# Altium schematic sheet MOS输出.SchDoc
size A4
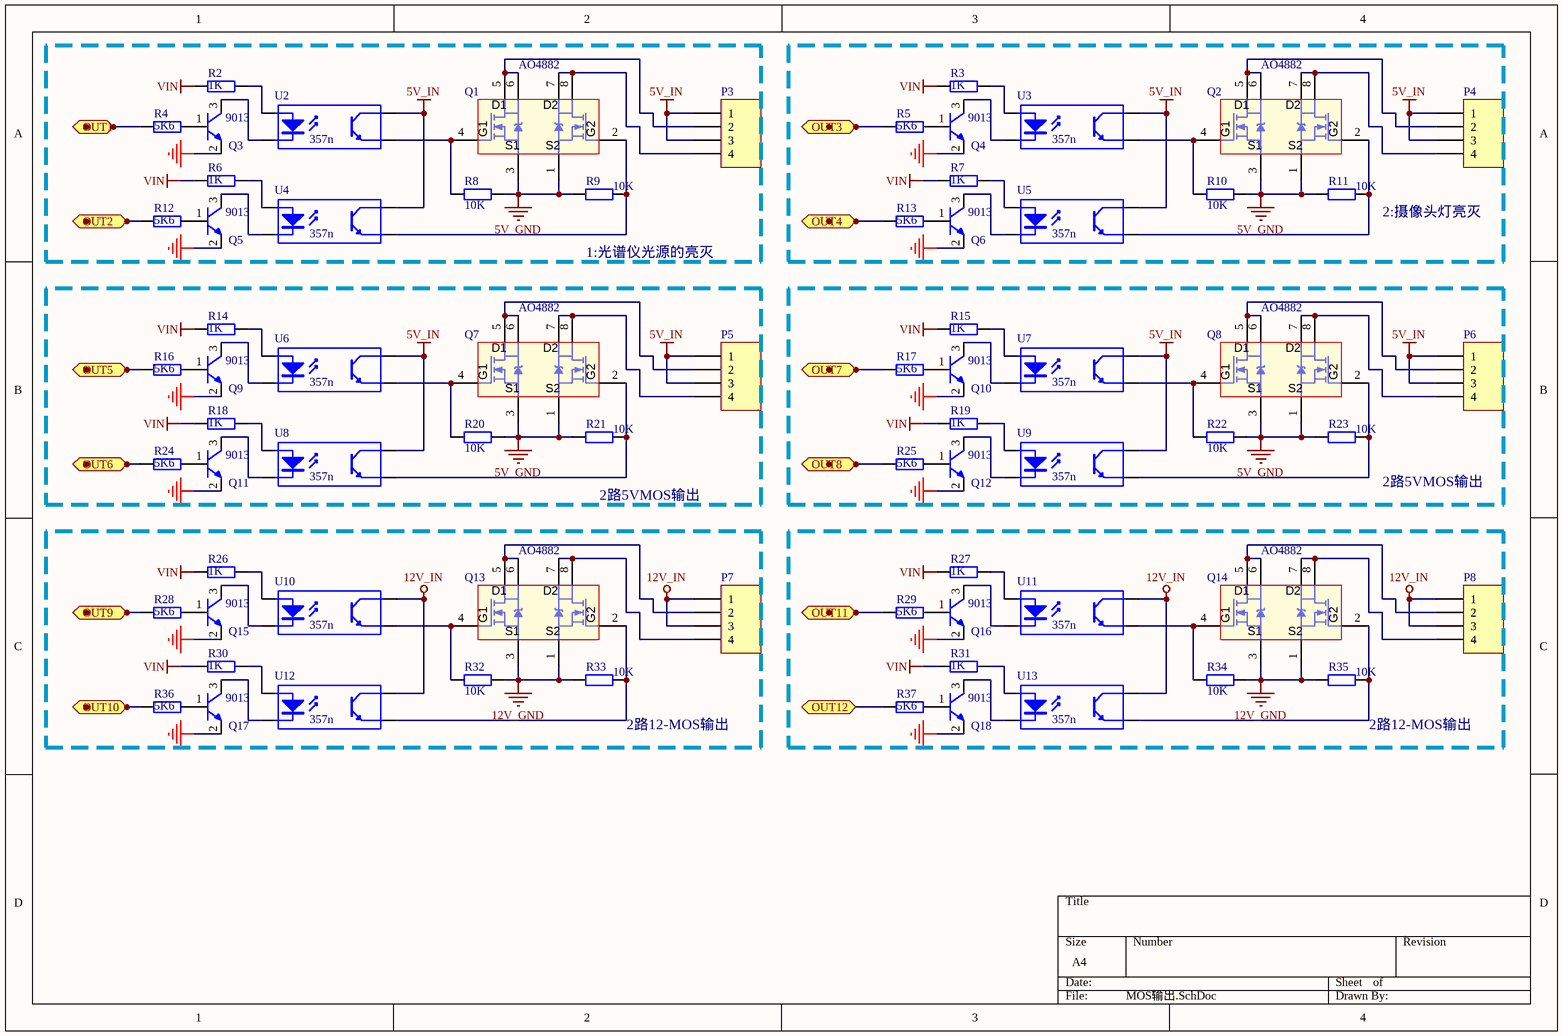
[diagram p0: MOS输出.SchDoc]

## Parts
P3  (no value)  [CAN3.81W/4]
P4  (no value)  [CAN3.81W/4]
P5  (no value)  [CAN3.81W/4]
P6  (no value)  [CAN3.81W/4]
P7  (no value)  [CAN3.81W/4]
P8  (no value)  [CAN3.81W/4]
Q1  AO4882  [so8]
Q2  AO4882  [so8]
Q3  9013  [sot-23]
Q4  9013  [sot-23]
Q5  9013  [sot-23]
Q6  9013  [sot-23]
Q7  AO4882  [so8]
Q8  AO4882  [so8]
Q9  9013  [sot-23]
Q10  9013  [sot-23]
Q11  9013  [sot-23]
Q12  9013  [sot-23]
Q13  AO4882  [so8]
Q14  AO4882  [so8]
Q15  9013  [sot-23]
Q16  9013  [sot-23]
Q17  9013  [sot-23]
Q18  9013  [sot-23]
R2  1K  [1608]
R3  1K  [1608]
R4  5K6  [1608]
R5  5K6  [1608]
R6  1K  [1608]
R7  1K  [1608]
R8  10K  [1608]
R9  10K  [1608]
R10  10K  [1608]
R11  10K  [1608]
R12  5K6  [1608]
R13  5K6  [1608]
R14  1K  [1608]
R15  1K  [1608]
R16  5K6  [1608]
R17  5K6  [1608]
R18  1K  [1608]
R19  1K  [1608]
R20  10K  [1608]
R21  10K  [1608]
R22  10K  [1608]
R23  10K  [1608]
R24  5K6  [1608]
R25  5K6  [1608]
R26  1K  [1608]
R27  1K  [1608]
R28  5K6  [1608]
R29  5K6  [1608]
R30  1K  [1608]
R31  1K  [1608]
R32  10K  [1608]
R33  10K  [1608]
R34  10K  [1608]
R35  10K  [1608]
R36  5K6  [1608]
R37  5K6  [1608]
U2  357n  [375N]
U3  357n  [375N]
U4  357n  [375N]
U5  357n  [375N]
U6  357n  [375N]
U7  357n  [375N]
U8  357n  [375N]
U9  357n  [375N]
U10  357n  [375N]
U11  357n  [375N]
U12  357n  [375N]
U13  357n  [375N]

## Blocks framed on the sheet
1:光谱仪光源的亮灭: P3 Q1 Q3 Q5 R2 R4 R6 R8 R9 R12 U2 U4
2:摄像头灯亮灭: P4 Q2 Q4 Q6 R3 R5 R7 R10 R11 R13 U3 U5
2路5VMOS输出: P5 Q7 Q9 Q11 R14 R16 R18 R20 R21 R24 U6 U8
2路5VMOS输出: P6 Q8 Q10 Q12 R15 R17 R19 R22 R23 R25 U7 U9
2路12-MOS输出: P7 Q13 Q15 Q17 R26 R28 R30 R32 R33 R36 U10 U12
2路12-MOS输出: P8 Q14 Q16 Q18 R27 R29 R31 R34 R35 R37 U11 U13

## Ports
OUT1, OUT2, OUT3, OUT4, OUT5, OUT6, OUT7, OUT8, OUT9, OUT10, OUT11, OUT12

## Nets
5V_GND: Q1.1(S2) Q1.3(S1) Q2.1(S2) Q2.3(S1) Q7.1(S2) Q7.3(S1) Q8.1(S2) Q8.3(S1) R8.1 R9.2 R10.1 R11.2 R20.1 R21.2 R22.1 R23.2
5V_IN: P3.1 P3.3 P4.1 P4.3 P5.1 P5.3 P6.1 P6.3 U2.4(C) U3.4(C) U4.4(C) U5.4(C) U6.4(C) U7.4(C) U8.4(C) U9.4(C)
12V_GND: Q13.1(S2) Q13.3(S1) Q14.1(S2) Q14.3(S1) R32.1 R33.2 R34.1 R35.2
12V_IN: P7.1 P7.3 P8.1 P8.3 U10.4(C) U11.4(C) U12.4(C) U13.4(C)
GND: Q3.2(E) Q4.2(E) Q5.2(E) Q6.2(E) Q9.2(E) Q10.2(E) Q11.2(E) Q12.2(E) Q15.2(E) Q16.2(E) Q17.2(E) Q18.2(E)
VIN: R2.2 R3.2 R6.2 R7.2 R14.2 R15.2 R18.2 R19.2 R26.2 R27.2 R30.2 R31.2
OUT1: R4.2 ; port OUT1
OUT2: R12.2 ; port OUT2
OUT3: R5.2 ; port OUT3
OUT4: R13.2 ; port OUT4
OUT5: R16.2 ; port OUT5
OUT6: R24.2 ; port OUT6
OUT7: R17.2 ; port OUT7
OUT8: R25.2 ; port OUT8
OUT9: R28.2 ; port OUT9
OUT10: R36.2 ; port OUT10
OUT11: R29.2 ; port OUT11
OUT12: R37.2 ; port OUT12
NetP3_2: P3.2 Q1.5(D1) Q1.6(D1)
NetP3_4: P3.4 Q1.7(D2) Q1.8(D2)
NetP4_2: P4.2 Q2.5(D1) Q2.6(D1)
NetP4_4: P4.4 Q2.7(D2) Q2.8(D2)
NetP5_2: P5.2 Q7.5(D1) Q7.6(D1)
NetP5_4: P5.4 Q7.7(D2) Q7.8(D2)
NetP6_2: P6.2 Q8.5(D1) Q8.6(D1)
NetP6_4: P6.4 Q8.7(D2) Q8.8(D2)
NetP7_2: P7.2 Q13.5(D1) Q13.6(D1)
NetP7_4: P7.4 Q13.7(D2) Q13.8(D2)
NetP8_2: P8.2 Q14.5(D1) Q14.6(D1)
NetP8_4: P8.4 Q14.7(D2) Q14.8(D2)
NetQ1_2: Q1.2(G2) R9.1 U4.3(E)
NetQ1_4: Q1.4(G1) R8.2 U2.3(E)
NetQ2_2: Q2.2(G2) R11.1 U5.3(E)
NetQ2_4: Q2.4(G1) R10.2 U3.3(E)
NetQ3_1: Q3.1(B) R4.1
NetQ3_3: Q3.3(C) U2.2(K)
NetQ4_1: Q4.1(B) R5.1
NetQ4_3: Q4.3(C) U3.2(K)
NetQ5_1: Q5.1(B) R12.1
NetQ5_3: Q5.3(C) U4.2(K)
NetQ6_1: Q6.1(B) R13.1
NetQ6_3: Q6.3(C) U5.2(K)
NetQ7_2: Q7.2(G2) R21.1 U8.3(E)
NetQ7_4: Q7.4(G1) R20.2 U6.3(E)
NetQ8_2: Q8.2(G2) R23.1 U9.3(E)
NetQ8_4: Q8.4(G1) R22.2 U7.3(E)
NetQ9_1: Q9.1(B) R16.1
NetQ9_3: Q9.3(C) U6.2(K)
NetQ10_1: Q10.1(B) R17.1
NetQ10_3: Q10.3(C) U7.2(K)
NetQ11_1: Q11.1(B) R24.1
NetQ11_3: Q11.3(C) U8.2(K)
NetQ12_1: Q12.1(B) R25.1
NetQ12_3: Q12.3(C) U9.2(K)
NetQ13_2: Q13.2(G2) R33.1 U12.3(E)
NetQ13_4: Q13.4(G1) R32.2 U10.3(E)
NetQ14_2: Q14.2(G2) R35.1 U13.3(E)
NetQ14_4: Q14.4(G1) R34.2 U11.3(E)
NetQ15_1: Q15.1(B) R28.1
NetQ15_3: Q15.3(C) U10.2(K)
NetQ16_1: Q16.1(B) R29.1
NetQ16_3: Q16.3(C) U11.2(K)
NetQ17_1: Q17.1(B) R36.1
NetQ17_3: Q17.3(C) U12.2(K)
NetQ18_1: Q18.1(B) R37.1
NetQ18_3: Q18.3(C) U13.2(K)
NetR2_1: R2.1 U2.1(A)
NetR3_1: R3.1 U3.1(A)
NetR6_1: R6.1 U4.1(A)
NetR7_1: R7.1 U5.1(A)
NetR14_1: R14.1 U6.1(A)
NetR15_1: R15.1 U7.1(A)
NetR18_1: R18.1 U8.1(A)
NetR19_1: R19.1 U9.1(A)
NetR26_1: R26.1 U10.1(A)
NetR27_1: R27.1 U11.1(A)
NetR30_1: R30.1 U12.1(A)
NetR31_1: R31.1 U13.1(A)

## Library data of the parts
P3-P8 = Header 4: Header, 4-Pin; LatestRevisionDate: 17-Jul-2002; LatestRevisionNote: Re-released for DXP Platform.; Publisher: Altium Limited
Q1 Q2 Q7 Q8 Q13 Q14 = AO4882 MOSFET 2N-CH 40V 8A 8SOIC: Mosfet Array 2 N-Channel (Dual) 40V 8A 2W Surface Mount 8-SOIC; MF: Alpha & Omega Semiconductor Inc.; MPN: AO4882
Q3-Q6 Q9-Q12 Q15-Q18 = NPNBT
R2-R7 R12-R19 R24-R31 R36 R37 = Res2: Resistor; Value: 220R; Published: 8-Jun-2000; LatestRevisionDate: 17-Jul-2002; LatestRevisionNote: Re-released for DXP Platform.; PackageReference: AXIAL-0.4; Publisher: Altium Limited
R8-R11 R20-R23 R32-R35 = Res2: Resistor; Published: 8-Jun-2000; LatestRevisionDate: 17-Jul-2002; LatestRevisionNote: Re-released for DXP Platform.; PackageReference: AXIAL-0.4; Publisher: Altium Limited; Value: 10K
U2-U13 = Optoisolator1: 4-Pin Phototransistor Optocoupler; Published: 24-Mar-1999; LatestRevisionDate: 04-Mar-2005; LatestRevisionNote: Sch pins 3 & 4 Swapped.; DatasheetDocument: Nov-2003; PackageReference: DIP-4; Publisher: Altium Limited